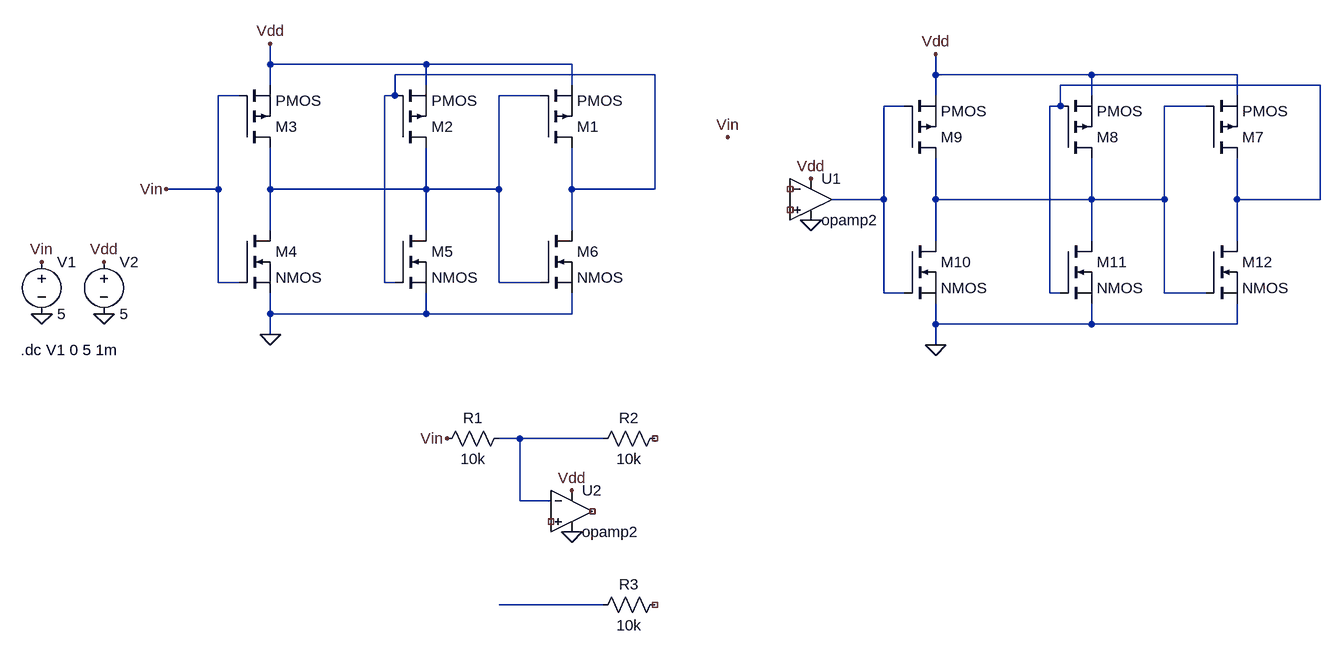
[diagram p0: schematic Draft1.asc]
Draft1.asc, the LTspice schematic file:
Version 4
SHEET 1 1380 864
WIRE -240 -16 -240 -48
WIRE 0 -16 -240 -16
WIRE 224 -16 0 -16
WIRE 352 0 -48 0
WIRE 784 0 784 -32
WIRE 1024 0 784 0
WIRE 1248 0 1024 0
WIRE -240 16 -240 -16
WIRE 0 16 0 -16
WIRE 224 16 224 -16
WIRE 1376 16 976 16
WIRE -288 32 -320 32
WIRE -48 32 -48 0
WIRE -48 32 -64 32
WIRE 176 32 112 32
WIRE 784 32 784 0
WIRE 1024 32 1024 0
WIRE 1248 32 1248 0
WIRE 736 48 704 48
WIRE 976 48 976 16
WIRE 976 48 960 48
WIRE 1200 48 1136 48
WIRE -320 176 -320 32
WIRE -320 176 -400 176
WIRE -240 176 -240 112
WIRE 0 176 0 112
WIRE 0 176 -240 176
WIRE 112 176 112 32
WIRE 112 176 0 176
WIRE 224 176 224 112
WIRE 352 176 352 0
WIRE 352 176 224 176
WIRE 704 192 704 48
WIRE 704 192 624 192
WIRE 784 192 784 128
WIRE 1024 192 1024 128
WIRE 1024 192 784 192
WIRE 1136 192 1136 48
WIRE 1136 192 1024 192
WIRE 1248 192 1248 128
WIRE 1376 192 1376 16
WIRE 1376 192 1248 192
WIRE -240 240 -240 176
WIRE 0 240 0 176
WIRE 224 240 224 176
WIRE 784 256 784 192
WIRE 1024 256 1024 192
WIRE 1248 256 1248 192
WIRE -320 320 -320 176
WIRE -288 320 -320 320
WIRE -64 320 -64 32
WIRE -48 320 -64 320
WIRE 112 320 112 176
WIRE 176 320 112 320
WIRE 704 336 704 192
WIRE 736 336 704 336
WIRE 960 336 960 48
WIRE 976 336 960 336
WIRE 1136 336 1136 192
WIRE 1200 336 1136 336
WIRE -240 368 -240 336
WIRE 0 368 0 336
WIRE 0 368 -240 368
WIRE 224 368 224 336
WIRE 224 368 0 368
WIRE 784 384 784 352
WIRE 1024 384 1024 352
WIRE 1024 384 784 384
WIRE 1248 384 1248 352
WIRE 1248 384 1024 384
WIRE -240 400 -240 368
WIRE 784 416 784 384
WIRE 144 560 112 560
WIRE 272 560 144 560
WIRE 144 656 144 560
WIRE 192 656 144 656
WIRE 272 816 112 816
FLAG -496 368 0
FLAG -592 368 0
FLAG -592 288 Vin
FLAG -496 288 Vdd
FLAG -240 -48 Vdd
FLAG -240 400 0
FLAG -400 176 Vin
FLAG 784 -32 Vdd
FLAG 784 416 0
FLAG 592 160 Vdd
FLAG 592 224 0
FLAG 464 96 Vin
FLAG 224 640 Vdd
FLAG 224 704 0
FLAG 32 560 Vin
SYMBOL pmos 176 112 M180
SYMATTR InstName M1
SYMBOL pmos -48 112 M180
SYMATTR InstName M2
SYMBOL pmos -288 112 M180
SYMATTR InstName M3
SYMBOL nmos -288 240 R0
SYMATTR InstName M4
SYMBOL nmos -48 240 R0
SYMATTR InstName M5
SYMBOL nmos 176 240 R0
SYMATTR InstName M6
SYMBOL voltage -592 272 R0
WINDOW 123 0 0 Left 0
WINDOW 39 0 0 Left 0
SYMATTR InstName V1
SYMATTR Value 5
SYMBOL voltage -496 272 R0
WINDOW 123 0 0 Left 0
WINDOW 39 0 0 Left 0
SYMATTR InstName V2
SYMATTR Value 5
SYMBOL pmos 1200 128 M180
SYMATTR InstName M7
SYMBOL pmos 976 128 M180
SYMATTR InstName M8
SYMBOL pmos 736 128 M180
SYMATTR InstName M9
SYMBOL nmos 736 256 R0
SYMATTR InstName M10
SYMBOL nmos 976 256 R0
SYMATTR InstName M11
SYMBOL nmos 1200 256 R0
SYMATTR InstName M12
SYMBOL OpAmps\\opamp2 592 128 R0
SYMATTR InstName U1
SYMBOL OpAmps\\opamp2 224 608 R0
SYMATTR InstName U2
SYMBOL res 128 544 R90
WINDOW 0 0 56 VBottom 2
WINDOW 3 32 56 VTop 2
SYMATTR InstName R1
SYMATTR Value 10k
SYMBOL res 368 544 R90
WINDOW 0 0 56 VBottom 2
WINDOW 3 32 56 VTop 2
SYMATTR InstName R2
SYMATTR Value 10k
SYMBOL res 368 800 R90
WINDOW 0 0 56 VBottom 2
WINDOW 3 32 56 VTop 2
SYMATTR InstName R3
SYMATTR Value 10k
TEXT -624 424 Left 2 !.dc V1 0 5 1m

The netlist it stands for:
* Draft1.asc
M1 N001 N003 Vdd Vdd PMOS
M2 N003 N001 Vdd Vdd PMOS
M3 N003 Vin Vdd Vdd PMOS
M4 N003 Vin 0 0 NMOS
M5 N003 N001 0 0 NMOS
M6 N001 N003 0 0 NMOS
V1 Vin 0 5
V2 Vdd 0 5
M7 N002 N005 Vdd Vdd PMOS
M8 N005 N002 Vdd Vdd PMOS
M9 N005 N004 Vdd Vdd PMOS
M10 N005 N004 0 0 NMOS
M11 N005 N002 0 0 NMOS
M12 N002 N005 0 0 NMOS
XU1 NC_01 NC_02 Vdd 0 N004 opamp2  ; pins In+ In- V+ V- OUT
XU2 NC_03 N006 Vdd 0 NC_04 opamp2  ; pins In+ In- V+ V- OUT
R1 N006 Vin 10k
R2 NC_05 N006 10k
R3 NC_06 N007 10k
.model NMOS NMOS
.model PMOS PMOS
.lib standard.mos
.dc V1 0 5 1m
.backanno
.end